# Altium schematic sheet RELAY.SchDoc
size A4; SheetNumber: 8; SheetTotal: 8
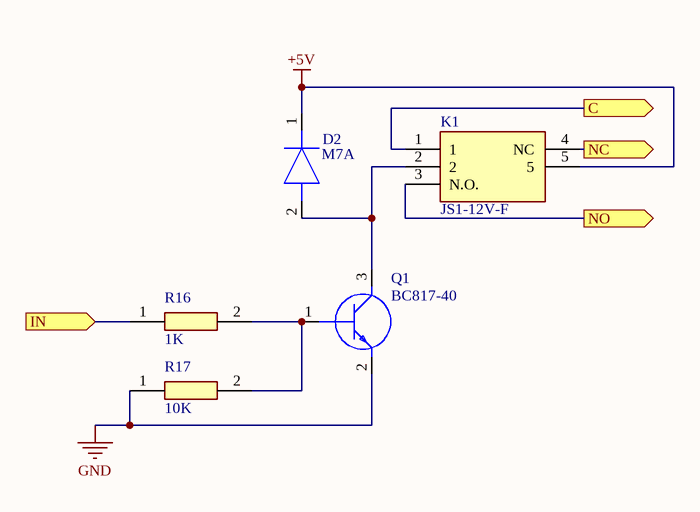
[diagram p0: RELAY.SchDoc]

## Parts
D2  M7A  [DIOM5027X262N]
K1  JS1-12V-F  [JS1-12V-F_1]
Q1  BC817-40  [BC81740215]
R16  1K  [RESC3216X75N]
R17  10K  [RESC3216X75N]

## Ports
C (out), IN (in), NC (out), NO (out)

## Nets
+5V: D2.1(K) K1.5
GND: Q1.2(E) R17.1
C: K1.1 ; port C
IN: R16.1 ; port IN
NC: K1.4(NC) ; port NC
NO: K1.3(N.O.) ; port NO
NetD2_2: D2.2(A) K1.2 Q1.3(C)
NetQ1_1: Q1.1(B) R16.2 R17.2

## Library data of the parts
D2 = M7A: Diode; Manufacturer_Name: HY Electronic; Height: 2.62mm; Manufacturer_Part_Number: M7A
K1 = JS1-12V-F: Relay or Contactor; Manufacturer_Name: Panasonic; Datasheet Link: https://datasheet.datasheetarchive.com/originals/distributors/Datasheets-24/DSA-473864.pdf; Manufacturer_Part_Number: JS1-12V-F; Mouser Part Number: 769-JS1-12V-F; Mouser Price/Stock: https://www.mouser.co.uk/ProductDetail/Panasonic-Industrial-Devices/JS1-12V-F?qs=UO%2Fx91QLkSAl%252Bp0dnjREtA%3D%3D; Arrow Part Number: JS1-12V-F; Arrow Price/Stock: https://www.arrow.com/en/products/js1-12v-f/panasonic
Q1 = BC817-40,215: Transistor BJT NPN; Manufacturer_Name: Nexperia; Datasheet Link: https://assets.nexperia.com/documents/data-sheet/BC817_SER.pdf; Height: 1.1mm; Manufacturer_Part_Number: BC817-40,215; Mouser Part Number: 771-BC817-40-T/R; Mouser Price/Stock: https://www.mouser.co.uk/ProductDetail/Nexperia/BC817-40215?qs=me8TqzrmIYU%252B245p8hOLaQ%3D%3D; Arrow Part Number: BC817-40,215; Arrow Price/Stock: https://www.arrow.com/en/products/bc817-40215/nexperia?region=nac
R16 R17 = CR1206-F_-2R00ELF: Resistor; Manufacturer_Name: Bourns; Manufacturer_Part_Number: CR1206-F/-2R00ELF; Height: 0.75mm; Mouser Part Number: 652-CR1206-F/2R00ELF; Mouser Price/Stock: https://www.mouser.co.uk/ProductDetail/Bourns/CR1206-F-2R00ELF?qs=W%2FMpXkg%252BdQ47Z%2FeZv1nDSg%3D%3D